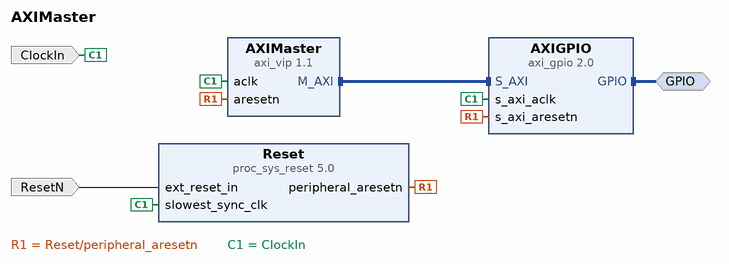
[diagram p0: block diagram of the top level]
# Vivado block design AXIMaster, xc7z010clg400-1, Vivado 2019.2
create_bd_design AXIMaster

create_bd_intf_port -mode Master -vlnv xilinx.com:interface:gpio_rtl:1.0 GPIO
create_bd_port -dir I -type clk ClockIn
set_property -dict {CONFIG.FREQ_HZ 125000000} [get_bd_ports ClockIn]
create_bd_port -dir I -type rst ResetN

create_bd_cell -type ip -vlnv xilinx.com:ip:axi_vip:1.1 AXIMaster
set_property -dict [list \
  CONFIG.ADDR_WIDTH 32 \
  CONFIG.DATA_WIDTH 32 \
  CONFIG.HAS_BRESP 0 \
  CONFIG.HAS_PROT 0 \
  CONFIG.HAS_RRESP 0 \
  CONFIG.HAS_WSTRB 0 \
  CONFIG.INTERFACE_MODE MASTER \
  CONFIG.PROTOCOL AXI4LITE \
  CONFIG.READ_WRITE_MODE READ_WRITE \
] [get_bd_cells AXIMaster]
create_bd_cell -type ip -vlnv xilinx.com:ip:proc_sys_reset:5.0 Reset
create_bd_cell -type ip -vlnv xilinx.com:ip:axi_gpio:2.0 AXIGPIO
set_property -dict {CONFIG.C_ALL_INPUTS 1 CONFIG.C_GPIO_WIDTH 2} [get_bd_cells AXIGPIO]

# ---- connections ----

connect_bd_intf_net -intf_net axi_gpio_0_GPIO [get_bd_intf_ports GPIO] [get_bd_intf_pins AXIGPIO/GPIO]
connect_bd_intf_net [get_bd_intf_pins AXIGPIO/S_AXI] [get_bd_intf_pins AXIMaster/M_AXI]
connect_bd_net -net rst_ClockingWizard_8M_peripheral_aresetn [get_bd_pins Reset/peripheral_aresetn] \
  [get_bd_pins AXIMaster/aresetn] [get_bd_pins AXIGPIO/s_axi_aresetn]
connect_bd_net -net ext_reset_in_0_1 [get_bd_ports ResetN] [get_bd_pins Reset/ext_reset_in]
connect_bd_net [get_bd_ports ClockIn] [get_bd_pins AXIGPIO/s_axi_aclk] [get_bd_pins AXIMaster/aclk] [get_bd_pins Reset/slowest_sync_clk]

# ---- address map ----
assign_bd_address -offset 0x40000000 -range 64K -target_address_space [get_bd_addr_spaces AXIMaster/Master_AXI] [get_bd_addr_segs AXIGPIO/S_AXI/Reg]

validate_bd_design
save_bd_design
